# Altium schematic sheet EDP and MIPI DSI Connectors.SchDoc: RK3399 COB Design V1.0
size A3; Author: ABC; Organization: Altium Limited; Address1: L3, 12a Rodborough Rd; Address2: Frenchs Forest; Address3: NSW; Address4: Australia 2086; DocumentNumber: 23; SheetNumber: 23; SheetTotal: 27; PROJECT CODE: A_V1.0
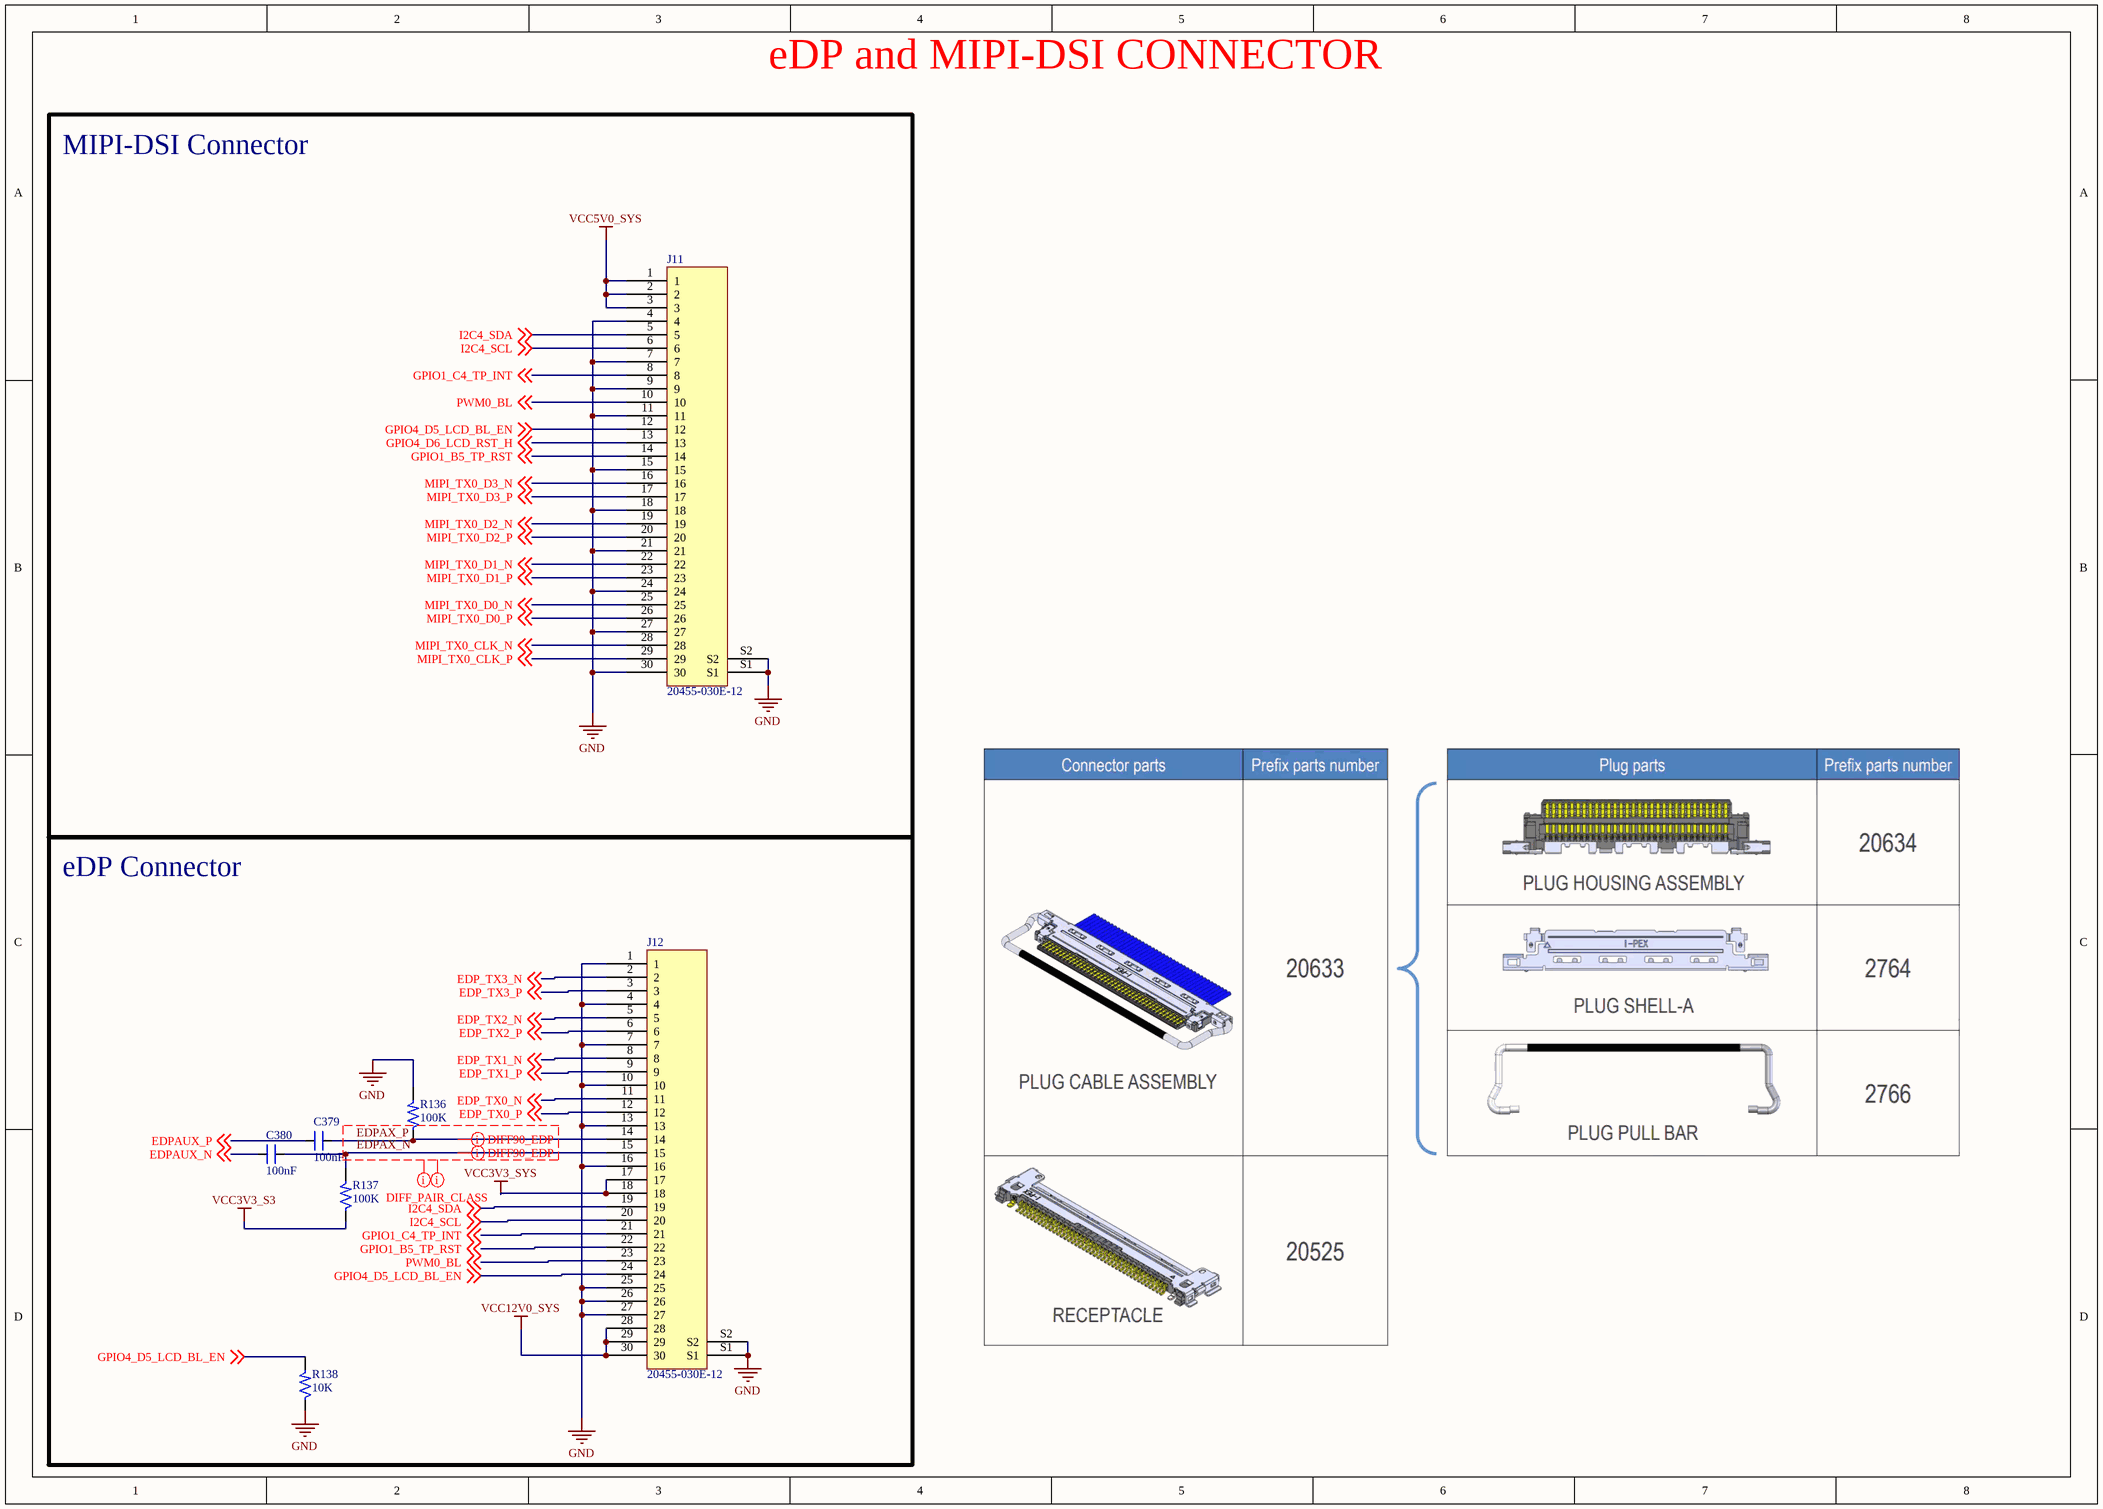
[diagram p0: EDP and MIPI DSI Connectors.SchDoc]

## Parts
C379  100nF  [CAP_0402]
C380  100nF  [CAP_0402]
J11  20455-030E-12  [CON30_19_68713014522 _SMD_RA]
J12  20455-030E-12  [CON30_19_68713014522 _SMD_RA]
R136  100K  [RES_0603]
R137  100K  [RES_0603]
R138  10K  [RES_0603]

## Blocks framed on the sheet
MIPI-DSI Connector: J11
eDP Connector: C379 C380 J12 R136-R138

## Nets
GND: J11.4 J11.7 J11.9 J11.11 J11.15 J11.18 J11.21 J11.24 J11.27 J11.30 J11.S1 J11.S2 J12.1 J12.4 J12.7 J12.10 J12.13 J12.16 J12.25 J12.26 J12.27 J12.S1 J12.S2 R136.2 R138.1
VCC3V3_S3: R137.1
VCC3V3_SYS: J12.17 J12.18
VCC5V0_SYS: J11.1 J11.2 J11.3
VCC12V0_SYS: J12.28 J12.29 J12.30
EDP_TX0_N: J12.11 ; off-sheet EDP_TX0_N
EDP_TX0_P: J12.12 ; off-sheet EDP_TX0_P
EDP_TX1_N: J12.8 ; off-sheet EDP_TX1_N
EDP_TX1_P: J12.9 ; off-sheet EDP_TX1_P
EDP_TX2_N: J12.5 ; off-sheet EDP_TX2_N
EDP_TX2_P: J12.6 ; off-sheet EDP_TX2_P
EDP_TX3_N: J12.2 ; off-sheet EDP_TX3_N
EDP_TX3_P: J12.3 ; off-sheet EDP_TX3_P
EDPAUX_N: C380.1 ; off-sheet EDPAUX_N
EDPAUX_P: C379.1 ; off-sheet EDPAUX_P
EDPAX_N: C380.2 J12.15 R137.2
EDPAX_P: C379.2 J12.14 R136.1
GPIO1_B5_TP_RST: J11.14 J12.22 ; off-sheet GPIO1_B5_TP_RST
GPIO1_C4_TP_INT: J11.8 J12.21 ; off-sheet GPIO1_C4_TP_INT
GPIO4_D5_LCD_BL_EN: J11.12 J12.24 R138.2 ; off-sheet GPIO4_D5_LCD_BL_EN
GPIO4_D6_LCD_RST_H: J11.13 ; off-sheet GPIO4_D6_LCD_RST_H
I2C4_SCL: J11.6 J12.20 ; off-sheet I2C4_SCL
I2C4_SDA: J11.5 J12.19 ; off-sheet I2C4_SDA
MIPI_TX0_CLK_N: J11.28 ; off-sheet MIPI_TX0_CLK_N
MIPI_TX0_CLK_P: J11.29 ; off-sheet MIPI_TX0_CLK_P
MIPI_TX0_D0_N: J11.25 ; off-sheet MIPI_TX0_D0_N
MIPI_TX0_D0_P: J11.26 ; off-sheet MIPI_TX0_D0_P
MIPI_TX0_D1_N: J11.22 ; off-sheet MIPI_TX0_D1_N
MIPI_TX0_D1_P: J11.23 ; off-sheet MIPI_TX0_D1_P
MIPI_TX0_D2_N: J11.19 ; off-sheet MIPI_TX0_D2_N
MIPI_TX0_D2_P: J11.20 ; off-sheet MIPI_TX0_D2_P
MIPI_TX0_D3_N: J11.16 ; off-sheet MIPI_TX0_D3_N
MIPI_TX0_D3_P: J11.17 ; off-sheet MIPI_TX0_D3_P
PWM0_BL: J11.10 J12.23 ; off-sheet PWM0_BL

## Layout directives
differential pair; differential pair class DIFF90_EDP: EDPAX_N, EDPAX_P
net class EDP SIG. GROUP: EDPAX_N, EDPAX_P
net class DIFF_PAIR_CLASS: EDPAX_N, EDPAX_P

## Notes on the sheet
- eDP and MIPI-DSI CONNECTOR
- TITLE:
- DOCUMENT NAME:
- SCALE 1:1
- This document is copyright of Esteempcb and shall not be revealed, produced, copied, in whole or in part, nor
- PROJECT CODE:
- TEMPLATE:
- A3
- AUTHOR:
- Sheet
- of
- used for any purpose other than submitted.

## Library data of the parts
C379 C380 = CAP_100nF-10V-10%-0402: 0.1µF ±10% 10V Ceramic Capacitor X7R 0402 (1005 Metric) /; Manufacturer: Yageo; Manufacturer Part Number: CC0402KRX7R6BB104; Case/Package: 0402; Supplier-1: Digikey
J11 J12 = CON-PLG-eDP_30X120455-030E-12-SMD: Micro Coaxial Connector 0.5mm Pitch; Manufacturer: RS Components; Mating Part Number: 687730200002; Alternate Part Number-1: NA; Manufacturer Part Number: 20455-030E-12; Case/Package: SMD; Supplier-1: Mouser; Supplier Part Number-1: 68713014522
R136 R137 = RES_100K-0.1W-1%-0603: 100 kOhms ±1% 0.1W, 1/10W Chip Resistor 0603 (1608 Metric) Automotive AEC-Q200 Thick Film /; Manufacturer: tackpole Electronics Inc; Manufacturer Part Number: RMCF0603FT100K; Case/Package: 0603; Supplier-1: Digikey
R138 = RES_10K-0.1W-1%-0603: 10 kOhms ±1% 0.1W, 1/10W Chip Resistor 0603 (1608 Metric) Thick Film /; Manufacturer: Yageo; Manufacturer Part Number: RC0603FR-0710KL; Case/Package: 0603; Supplier-1: Digikey